# EAGLE schematic RGBI2Cv2 (EAGLE 6.2)
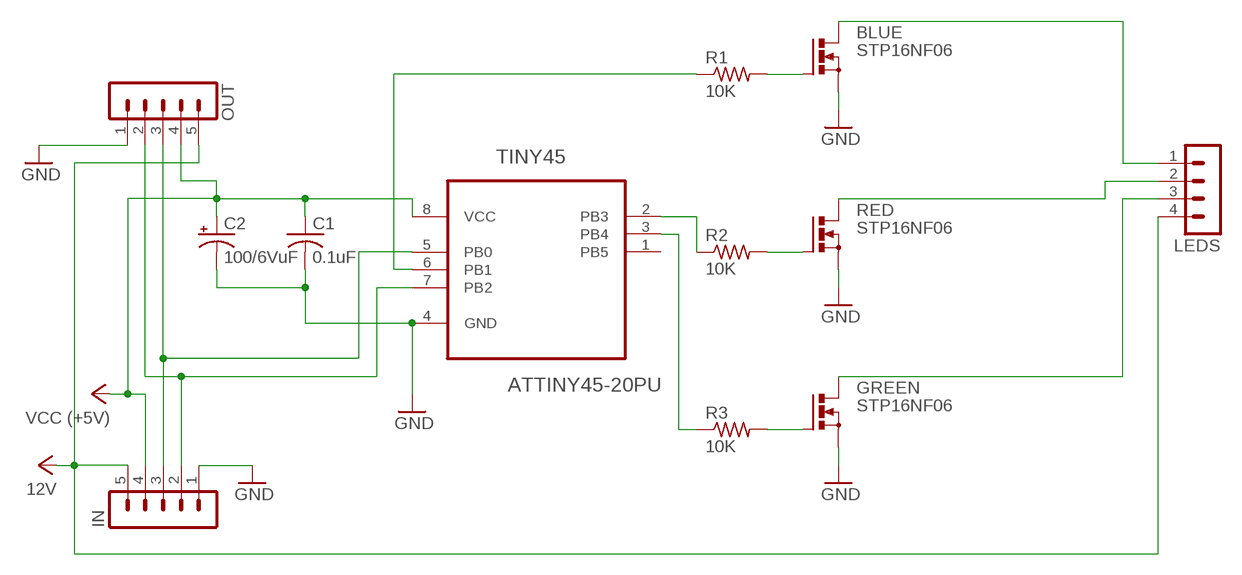
[diagram p0: schematic, sheet 1]

## Parts
BLUE  STP16NF06  PMOSFET_NTO220BH  [TO220BH]
C1  0.1uF  C-US025-025X050  [C025-025X050]
C2  100/6VuF  CPOL-USE2.5-6  [E2,5-6]
GREEN  STP16NF06  PMOSFET_NTO220BH  [TO220BH]
IN  MA05-1  [MA05-1]
LEDS  MA04-1  [MA04-1]
OUT  MA05-1  [MA05-1]
R1  10K  R-US_0207/7  [0207/7]
R2  10K  R-US_0207/7  [0207/7]
R3  10K  R-US_0207/7  [0207/7]
RED  STP16NF06  PMOSFET_NTO220BH  [TO220BH]
TINY45  ATTINY45-20PU  [DIP254P762X533-8]

## Nets
12V: IN.5 LEDS.4 OUT.5
GND: BLUE.S C1.2 C2.- GREEN.S IN.1 OUT.1 RED.S TINY45.4(GND)
N$1: BLUE.D LEDS.1
N$2: LEDS.2 RED.D
N$3: IN.2 OUT.2 TINY45.7(PB2)
N$4: IN.3 OUT.3 TINY45.5(PB0)
N$5: R1.1 TINY45.6(PB1)
N$6: BLUE.G R1.2
N$7: R2.2 RED.G
N$8: GREEN.G R3.2
N$9: R2.1 TINY45.2(PB3)
N$10: R3.1 TINY45.3(PB4)
N$11: GREEN.D LEDS.3
VCC5V: C1.1 C2.+ IN.4 OUT.4 TINY45.8(VCC) ; supply symbol labelled VCC (+5V)
Unconnected: TINY45.1(PB5)

## Library data of the parts
BLUE GREEN RED = transistor-power:PMOSFET_N: Power MOSFET N-Channel
C1 = minimidi:C-US: CAPACITOR, American symbol
C2 = minimidi:CPOL-US: POLARIZED CAPACITOR, American symbol
IN OUT = con-lstb:MA05-1: PIN HEADER; OC_FARNELL: unknown; OC_NEWARK: unknown
LEDS = con-lstb:MA04-1: PIN HEADER; OC_FARNELL: unknown; OC_NEWARK: unknown
R1-R3 = rcl:R-US_: RESISTOR, American symbol
TINY45 = Atmel_By_element14_Batch_1:ATTINY45-20PU: 8-bit Microcontroller with 2/4/8KBytes In-System Programmable Flash; MPN: ATTINY45-20PU; OC_FARNELL: 1288352; OC_NEWARK: 23M5072; PACKAGE: PDIP-8; SUPPLIER: Atmel